# Altium schematic sheet MCU.SchDoc
size A4
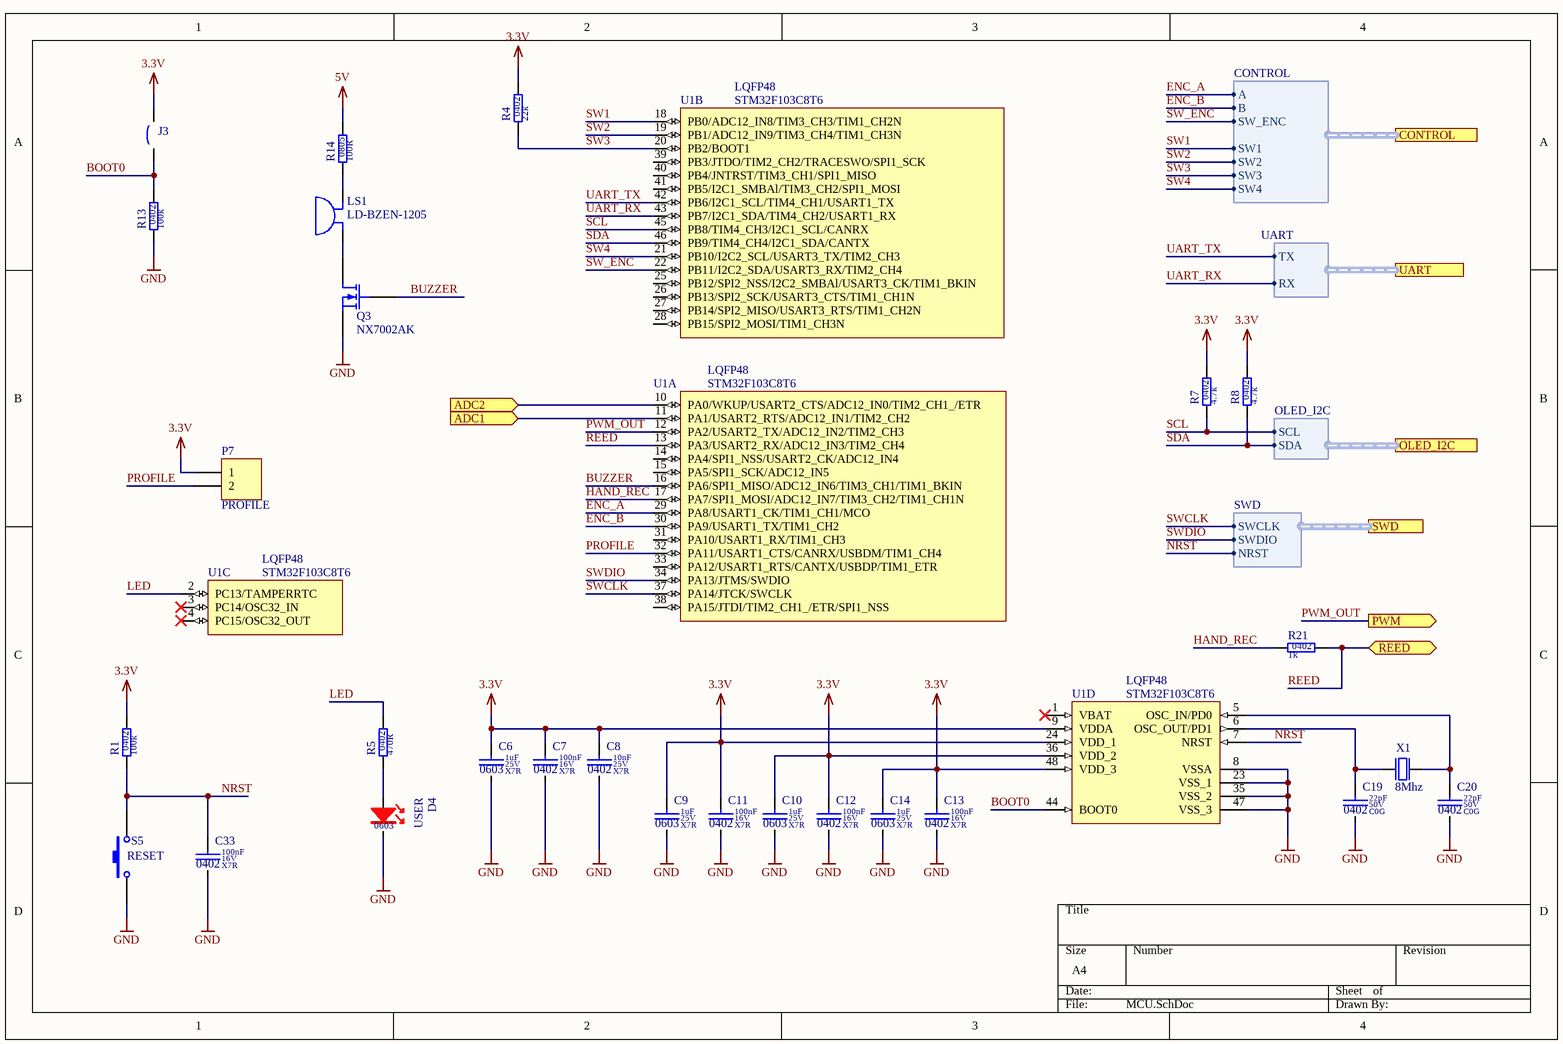
[diagram p0: MCU.SchDoc]

## Parts
C6  value 1uF  Dielectric: X7R  Voltage: 25V  SCH_Footprint: 0603  [C_0603_1608]  (hidden comment: Ceramic X7R)
C7  value 100nF  Dielectric: X7R  Voltage: 16V  SCH_Footprint: 0402  [C_0402_1005]  (hidden comment: Ceramic X7R)
C8  value 10nF  Dielectric: X7R  Voltage: 25V  SCH_Footprint: 0402  [C_0402_1005]  (hidden comment: Ceramic X7R)
C9  value 1uF  Dielectric: X7R  Voltage: 25V  SCH_Footprint: 0603  [C_0603_1608]  (hidden comment: Ceramic X7R)
C10  value 1uF  Dielectric: X7R  Voltage: 25V  SCH_Footprint: 0603  [C_0603_1608]  (hidden comment: Ceramic X7R)
C11  value 100nF  Dielectric: X7R  Voltage: 16V  SCH_Footprint: 0402  [C_0402_1005]  (hidden comment: Ceramic X7R)
C12  value 100nF  Dielectric: X7R  Voltage: 16V  SCH_Footprint: 0402  [C_0402_1005]  (hidden comment: Ceramic X7R)
C13  value 100nF  Dielectric: X7R  Voltage: 16V  SCH_Footprint: 0402  [C_0402_1005]  (hidden comment: Ceramic X7R)
C14  value 1uF  Dielectric: X7R  Voltage: 25V  SCH_Footprint: 0603  [C_0603_1608]  (hidden comment: Ceramic X7R)
C19  value 22pF  Dielectric: C0G  Voltage: 50V  SCH_Footprint: 0402  [C_0402_1005]  (hidden comment: Ceramic C0G)
C20  value 22pF  Dielectric: C0G  Voltage: 50V  SCH_Footprint: 0402  [C_0402_1005]  (hidden comment: Ceramic C0G)
C33  value 100nF  Dielectric: X7R  Voltage: 16V  SCH_Footprint: 0402  [C_0402_1005]  (hidden comment: Ceramic X7R)
D4  USER  SCH_Footprint: 0603  [OL_0603_1608]
J3  BOOT0  [Contact_Point_2_Pad]  (value not drawn)
LS1  LD-BZEN-1205  [LD-BZEN-1205]
P7  PROFILE  [P_HEADER_1x2_2.54]
Q3  NX7002AK  [NX7002AK.215]
R1  value 100k  SCH_Footprint: 0402  [R_0402_1005]  (hidden comment: Resistor)
R4  value 22k  SCH_Footprint: 0402  [R_0402_1005]  (hidden comment: Resistor)
R5  value 470R  SCH_Footprint: 0402  [R_0402_1005]  (hidden comment: Resistor)
R7  value 4.7k  SCH_Footprint: 0402  [R_0402_1005]  (hidden comment: Resistor)
R8  value 4.7k  SCH_Footprint: 0402  [R_0402_1005]  (hidden comment: Resistor)
R13  value 100k  SCH_Footprint: 0402  [R_0402_1005]  (hidden comment: Resistor)
R14  value 100R  SCH_Footprint: 0805  [R_0805_2012]  (hidden comment: Resistor)
R21  value 1k  SCH_Footprint: 0402  [R_0402_1005]  (hidden comment: Resistor)
S5  RESET  [S_TACTSWITCH3x6]
U1  SCH_Footprint: LQFP48  [LQFP48_7x7]  (hidden comment: STM32F103C8T6)  (parts A,B,C,D of 4)
X1  8MHz  [X_HC49_THT]

## Ports
ADC1 (in), ADC2 (in), CONTROL (harness CONTROL), OLED_I2C (harness OLED_I2C), PWM (out), REED (bidir), SWD (harness SWD), UART (harness UART)

## Harnesses
SWD: SWCLK, NRST, SWDIO
CONTROL: A, B, SW_ENC, SW1, SW2, SW3, SW4
OLED_I2C: SCL, SDA
UART: TX, RX

## Nets
3.3V: C6.1 C7.1 C8.1 C9.1 C10.1 C11.1 C12.1 C13.1 C14.1 J3.2 P7.1 R1.2 R4.2 R7.2 R8.2 U1.9(VDDA) U1.24(VDD_1) U1.36(VDD_2) U1.48(VDD_3)
5V: R14.2
GND: C6.2 C7.2 C8.2 C9.2 C10.2 C11.2 C12.2 C13.2 C14.2 C19.2 C20.2 C33.2 D4.1(K) Q3.2(S) R13.1 S5.1 U1.8(VSSA) U1.23(VSS_1) U1.35(VSS_2) U1.47(VSS_3)
ADC1: U1.11(PA1/USART2_RTS/ADC12_IN1/TIM2_CH2) ; port ADC1
ADC2: U1.10(PA0/WKUP/USART2_CTS/ADC12_IN0/TIM2_CH1_/ETR) ; port ADC2
BOOT0: J3.1 R13.2 U1.44(BOOT0)
BUZZER: Q3.1(G) U1.16(PA6/SPI1_MISO/ADC12_IN6/TIM3_CH1/TIM1_BKIN)
ENC_A: U1.29(PA8/USART1_CK/TIM1_CH1/MCO) ; port CONTROL.A
ENC_B: U1.30(PA9/USART1_TX/TIM1_CH2) ; port CONTROL.B
HAND_REC: R21.1 U1.17(PA7/SPI1_MOSI/ADC12_IN7/TIM3_CH2/TIM1_CH1N)
LED: R5.2 U1.2(PC13/TAMPERRTC)
NRST: C33.1 R1.1 S5.2 U1.7(NRST) ; port SWD.NRST
PROFILE: P7.2 U1.32(PA11/USART1_CTS/CANRX/USBDM/TIM1_CH4)
PWM_OUT: U1.12(PA2/USART2_TX/ADC12_IN2/TIM2_CH3) ; port PWM
REED: R21.2 U1.13(PA3/USART2_RX/ADC12_IN3/TIM2_CH4) ; port REED
SCL: R7.1 U1.45(PB8/TIM4_CH3/I2C1_SCL/CANRX) ; port OLED_I2C.SCL
SDA: R8.1 U1.46(PB9/TIM4_CH4/I2C1_SDA/CANTX) ; port OLED_I2C.SDA
SW1: U1.18(PB0/ADC12_IN8/TIM3_CH3/TIM1_CH2N) ; port CONTROL.SW1
SW2: U1.19(PB1/ADC12_IN9/TIM3_CH4/TIM1_CH3N) ; port CONTROL.SW2
SW3: R4.1 U1.20(PB2/BOOT1) ; port CONTROL.SW3
SW4: U1.21(PB10/I2C2_SCL/USART3_TX/TIM2_CH3) ; port CONTROL.SW4
SW_ENC: U1.22(PB11/I2C2_SDA/USART3_RX/TIM2_CH4) ; port CONTROL.SW_ENC
SWCLK: U1.37(PA14/JTCK/SWCLK) ; port SWD.SWCLK
SWDIO: U1.34(PA13/JTMS/SWDIO) ; port SWD.SWDIO
UART_RX: U1.43(PB7/I2C1_SDA/TIM4_CH2/USART1_RX) ; port UART.RX
UART_TX: U1.42(PB6/I2C1_SCL/TIM4_CH1/USART1_TX) ; port UART.TX
NetC19_1: C19.1 U1.6(OSC_OUT/PD1) X1.1
NetC20_1: C20.1 U1.5(OSC_IN/PD0) X1.2
NetD4_2: D4.2(A) R5.1
NetLS1_1: LS1.1 R14.1
NetLS1_2: LS1.2 Q3.3(D)

Not connected (* = marked no-connect by the designer): U1 1(VBAT)* 3(PC14/OSC32_IN)* 4(PC15/OSC32_OUT)* 14(PA4/SPI1_NSS/USART2_CK/ADC12_IN4) 15(PA5/SPI1_SCK/ADC12_IN5) 25(PB12/SPI2_NSS/I2C2_SMBAl/USART3_CK/TIM1_BKIN) 26(PB13/SPI2_SCK/USART3_CTS/TIM1_CH1N) 27(PB14/SPI2_MISO/USART3_RTS/TIM1_CH2N) 28(PB15/SPI2_MOSI/TIM1_CH3N) 31(PA10/USART1_RX/TIM1_CH3) 33(PA12/USART1_RTS/CANTX/USBDP/TIM1_ETR) 38(PA15/JTDI/TIM2_CH1_/ETR/SPI1_NSS) 39(PB3/JTDO/TIM2_CH2/TRACESWO/SPI1_SCK) 40(PB4/JNTRST/TIM3_CH1/SPI1_MISO) 41(PB5/I2C1_SMBAl/TIM3_CH2/SPI1_MOSI)

## Library data of the parts
C6 C9 C10 C14 = C_1uF_25V_X7R_0603_10: Capacitor; Manufacturer: Samsung; Manufacturer Part Number: CL10B105KA8NNNC; Tolerance (%): 10; Part Number: C_1uF_25V_X7R_0603_10; HelpURL: http://www.tme.eu/pl/Document/4a42202b32dab16128fe107dd69598cc/samsung-chip-cap.pdf; Supplier 1: TME; Supplier Part Number 1: CL10B105KA8NNNC; Supplier 2: RS Components; Supplier 3: Farnell; Supplier 4: Mouser; Supplier 5: Digi-Key
C7 C11-C13 C33 = C_100nF_16V_X7R_0402_10: Capacitor; Manufacturer: Murata; Manufacturer Part Number: GRM155R71C104KA88D; Tolerance (%): 10; Part Number: C_100nF_16V_X7R_0402_10; HelpURL: https://www.mouser.com/ds/2/281/c02e-2905.pdf; Supplier 1: TME; Supplier 2: RS Components; Supplier 3: Farnell; Supplier 4: Mouser; Supplier Part Number 4: 81-GRM155R71C104KA88; Supplier 5: Digi-Key
C8 = C_10nF_25V_X7R_0402_10: Capacitor; Manufacturer: Murata; Manufacturer Part Number: GRM155R71E103KA01D; Tolerance (%): 10; Part Number: C_10nF_25V_X7R_0402_10; HelpURL: http://www.tme.eu/en/Document/e3e731e59cc68b1ab6d46b158bb05733/MURATA_GRM.pdf; Supplier 1: TME; Supplier Part Number 1: GRM155R71E103KA01D; Supplier 2: RS Components; Supplier Part Number 2: 6242301; Supplier 3: Farnell; Supplier Part Number 3: 8819734; Supplier 4: Mouser; Supplier Part Number 4: 81-GRM36X103K25; Supplier 5: Digi-Key; Supplier Part Number 5: 490-1312-1-ND
C19 C20 = C_22pF_50V_C0G_0402_5: Capacitor; Manufacturer: AVX; Manufacturer Part Number: 04025A220JAT2A; Tolerance (%): 5; Part Number: C_22pF_50V_C0G_0402_5; HelpURL: http://datasheet.octopart.com/04025A220JAT2A-AVX-datasheet-9883399.pdf; Supplier 1: TME; Supplier Part Number 1: 04025A220JAT2A; Supplier 2: RS Components; Supplier Part Number 2: 6983087; Supplier 3: Farnell; Supplier Part Number 3: 2280776; Supplier 4: Mouser; Supplier Part Number 4: 581-04025A220J; Supplier 5: Digi-Key; Supplier Part Number 5: 478-1074-1-ND
D4 = OL_R_0603: LED_RED; Manufacturer: Lite-On; Value: LTST-C190KRKT; Part Number: OL_R_0603; HelpURL: https://datasheet.octopart.com/LTST-C190KRKT-Lite-On-datasheet-158191.pdf; Manufacturer Part Number: LTST-C190KRKT; Supplier 1: TME; Supplier Part Number 1: LTST-C190KRKT; Supplier 2: RS Components; Supplier Part Number 2: 1769795; Supplier 3: Farnell; Supplier 4: Mouser; Supplier Part Number 4: 859-LTST-C190KRKT; Supplier 5: Digi-Key; Supplier Part Number 5: 160-1436-1-ND
J3 = Contact_Point_2_Pad
LS1 = LD-BZEN-1205: Przetwornik dźwięku: elektromagnetyczny; THT; 2,4kHz; 40mA; H: 9mm
P7 = P_HEADER_1x2_2.54: Header, 2-Pin; Manufacturer: Connfly; Value: DS1021-1*2SF1-1; SCH_Footprint: 1x2 2.54mm; Part Number: P_HEADER_1x2_2.54; Component Type: Standard; HelpURL: http://www.tme.eu/en/Document/cc301e58a5da78cb543a94b5a5b7f06a/DS1021.pdf; Manufacturer Part Number: DS1021-1*2SF1-1; Supplier 1: TME; Supplier Part Number 1: ZL201-02G; Supplier 2: RS Components; Supplier 3: Farnell; Supplier 4: Mouser; Supplier 5: Digi-Key
Q3 = NX7002AK.215: Tranzystor: N-MOSFET; unipolarny; 60V; 0,12A; 325mW; SOT23
R1 R7 R8 R13 = R_100k_0402_1: Manufacturer: Yageo; Manufacturer Part Number: RC0402FR-07100KL; Voltage: 50V; Power: 63mW; Tolerance: 1%; Part Number: R_100k_0402_1; HelpURL: http://www.tme.eu/pl/Document/1a2bc76e2be68b3b1670068306778ce6/rc0402yageo.pdf; Supplier 1: TME; Supplier Part Number 1: RC0402FR-07100K; Supplier 2: RS Components; Supplier 3: Farnell; Supplier Part Number 3: 2131798; Supplier 4: Mouser; Supplier Part Number 4: 603-RC0402FR-07100KL; Supplier 5: Digi-Key; Supplier Part Number 5: 311-100KLRCT-ND
R4 = R_22k_0402_1: Manufacturer: Panasonic; Manufacturer Part Number: ERA-2AEB223X; Voltage: 50V; Power: 63mW; Tolerance: 1%; Part Number: R_22k_0402_1; HelpURL: http://www.mouser.com/ds/2/315/AOA0000C237-1100991.pdf; Supplier 1: TME; Supplier 2: RS Components; Supplier Part Number 2: 566557; Supplier 3: Farnell; Supplier Part Number 3: 1577719; Supplier 4: Mouser; Supplier Part Number 4: 667-ERA-2AEB223X; Supplier 5: Digi-Key; Supplier Part Number 5: P22KDCCT-ND
R5 = R_470R_0402_1: Manufacturer: Yageo; Manufacturer Part Number: RC0402FR-07470RL; Voltage: 50V; Power: 63mW; Tolerance: 1%; Part Number: R_470R_0402_1; HelpURL: http://datasheet.octopart.com/RC0402FR-07470RL-Yageo-datasheet-10408619.pdf; Supplier 1: TME; Supplier Part Number 1: RC0402FR-07470R; Supplier 2: RS Components; Supplier 3: Farnell; Supplier Part Number 3: 9239197; Supplier 4: Mouser; Supplier Part Number 4: 603-RC0402FR-07470RL; Supplier 5: Digi-Key; Supplier Part Number 5: 311-470LRCT-ND
R14 = R_100R_0805_1: Manufacturer: Yageo; Manufacturer Part Number: RC0805FR-07100RL; Voltage: 150V; Power: 125mW; Tolerance: 1%; Part Number: R_100R_0805_1; HelpURL: https://www.tme.eu/pl/Document/7b8fed8c112f8a94930279c22c957f7f/rc0805yageo.pdf; Supplier 1: TME; Supplier Part Number 1: RC0805FR-07100R; Supplier 2: RS Components; Supplier Part Number 2: 618-5135; Supplier 3: Farnell; Supplier Part Number 3: 9237364; Supplier 4: Mouser; Supplier Part Number 4: 603-RC0805FR-07100RL; Supplier 5: Digi-Key; Supplier Part Number 5: 311-100CRCT-ND
R21 = R_1k_0402_1: Manufacturer: Yageo; Manufacturer Part Number: RC0402FR-071K; Voltage: 50V; Power: 63mW; Tolerance: 1%; Part Number: R_1k_0402_1; HelpURL: http://www.tme.eu/pl/Document/1a2bc76e2be68b3b1670068306778ce6/rc0402yageo.pdf; Supplier 1: TME; Supplier Part Number 1: RC0402FR-071K; Supplier 2: RS Components; Supplier 3: Farnell; Supplier Part Number 3: 9239235; Supplier 4: Mouser; Supplier Part Number 4: 603-RC0402FR-071KP; Supplier 5: Digi-Key; Supplier Part Number 5: 311-1.00KLRCT-ND
S5 = S_TACTSWITCH: Tact Switch; Manufacturer: Ninigi; Manufacturer Part Number: TACTM-34N-F; SCH_Footprint: 3x6mm; Part Number: S_TACTSWITCH; Value: RESET; HelpURL: http://pl.ninigi.com/product/tactm-34n-f/pdf; Supplier 1: TME; Supplier Part Number 1: TACTM-34N-F; Supplier 2: RS Components; Supplier 3: Farnell; Supplier 4: Mouser; Supplier 5: Digi-Key
U1 = UP_STM32F103C8T6: Manufacturer: STMicroelectronics; Value: STM32F103C8T6; Part Number: UP_STM32F103C8T6; HelpURL: https://datasheet.octopart.com/STM32F103C8T6-STMicroelectronics-datasheet-48026265.pdf; Manufacturer Part Number: STM32F103C8T6; Supplier 1: TME; Supplier Part Number 1: STM32F103C8T6; Supplier 2: RS Components; Supplier Part Number 2: 1023545; Supplier 3: Farnell; Supplier Part Number 3: 1447637; Supplier 4: Mouser; Supplier Part Number 4: 511-STM32F103C8T6; Supplier 5: Digi-Key; Supplier Part Number 5: 497-6063-ND
X1 = X_HC49US-FF5F18-16.0000: Resonator Ceramic; Manufacturer Part Number: HC49US-FF3F18-16.0000; Manufacturer: Ilsi; SCH_Footprint: HC49 THT; Part Number: X_HC49US-FF5F18-16.0000; Value: 8Mhz; HelpURL: http://www.tme.eu/pl/Document/6c671fc2d1c29550257ca2d207d0534f/HC49US_Series.pdf; Supplier 1: TME; Supplier Part Number 1: HC49US-FF5F16.0000; Supplier 2: RS Components; Supplier 3: Farnell; Supplier 4: Mouser; Supplier 5: Digi-Key